# Altium schematic sheet FPGA_AudioCodec_Flash.SchDoc
size B; Organization: Altium Limited; Address1: L3, 12a Rodborough Rd; Address2: Frenchs Forest; Address3: NSW; Address4: Australia 2086; DocumentNumber: 1; SheetNumber: 1; SheetTotal: 6
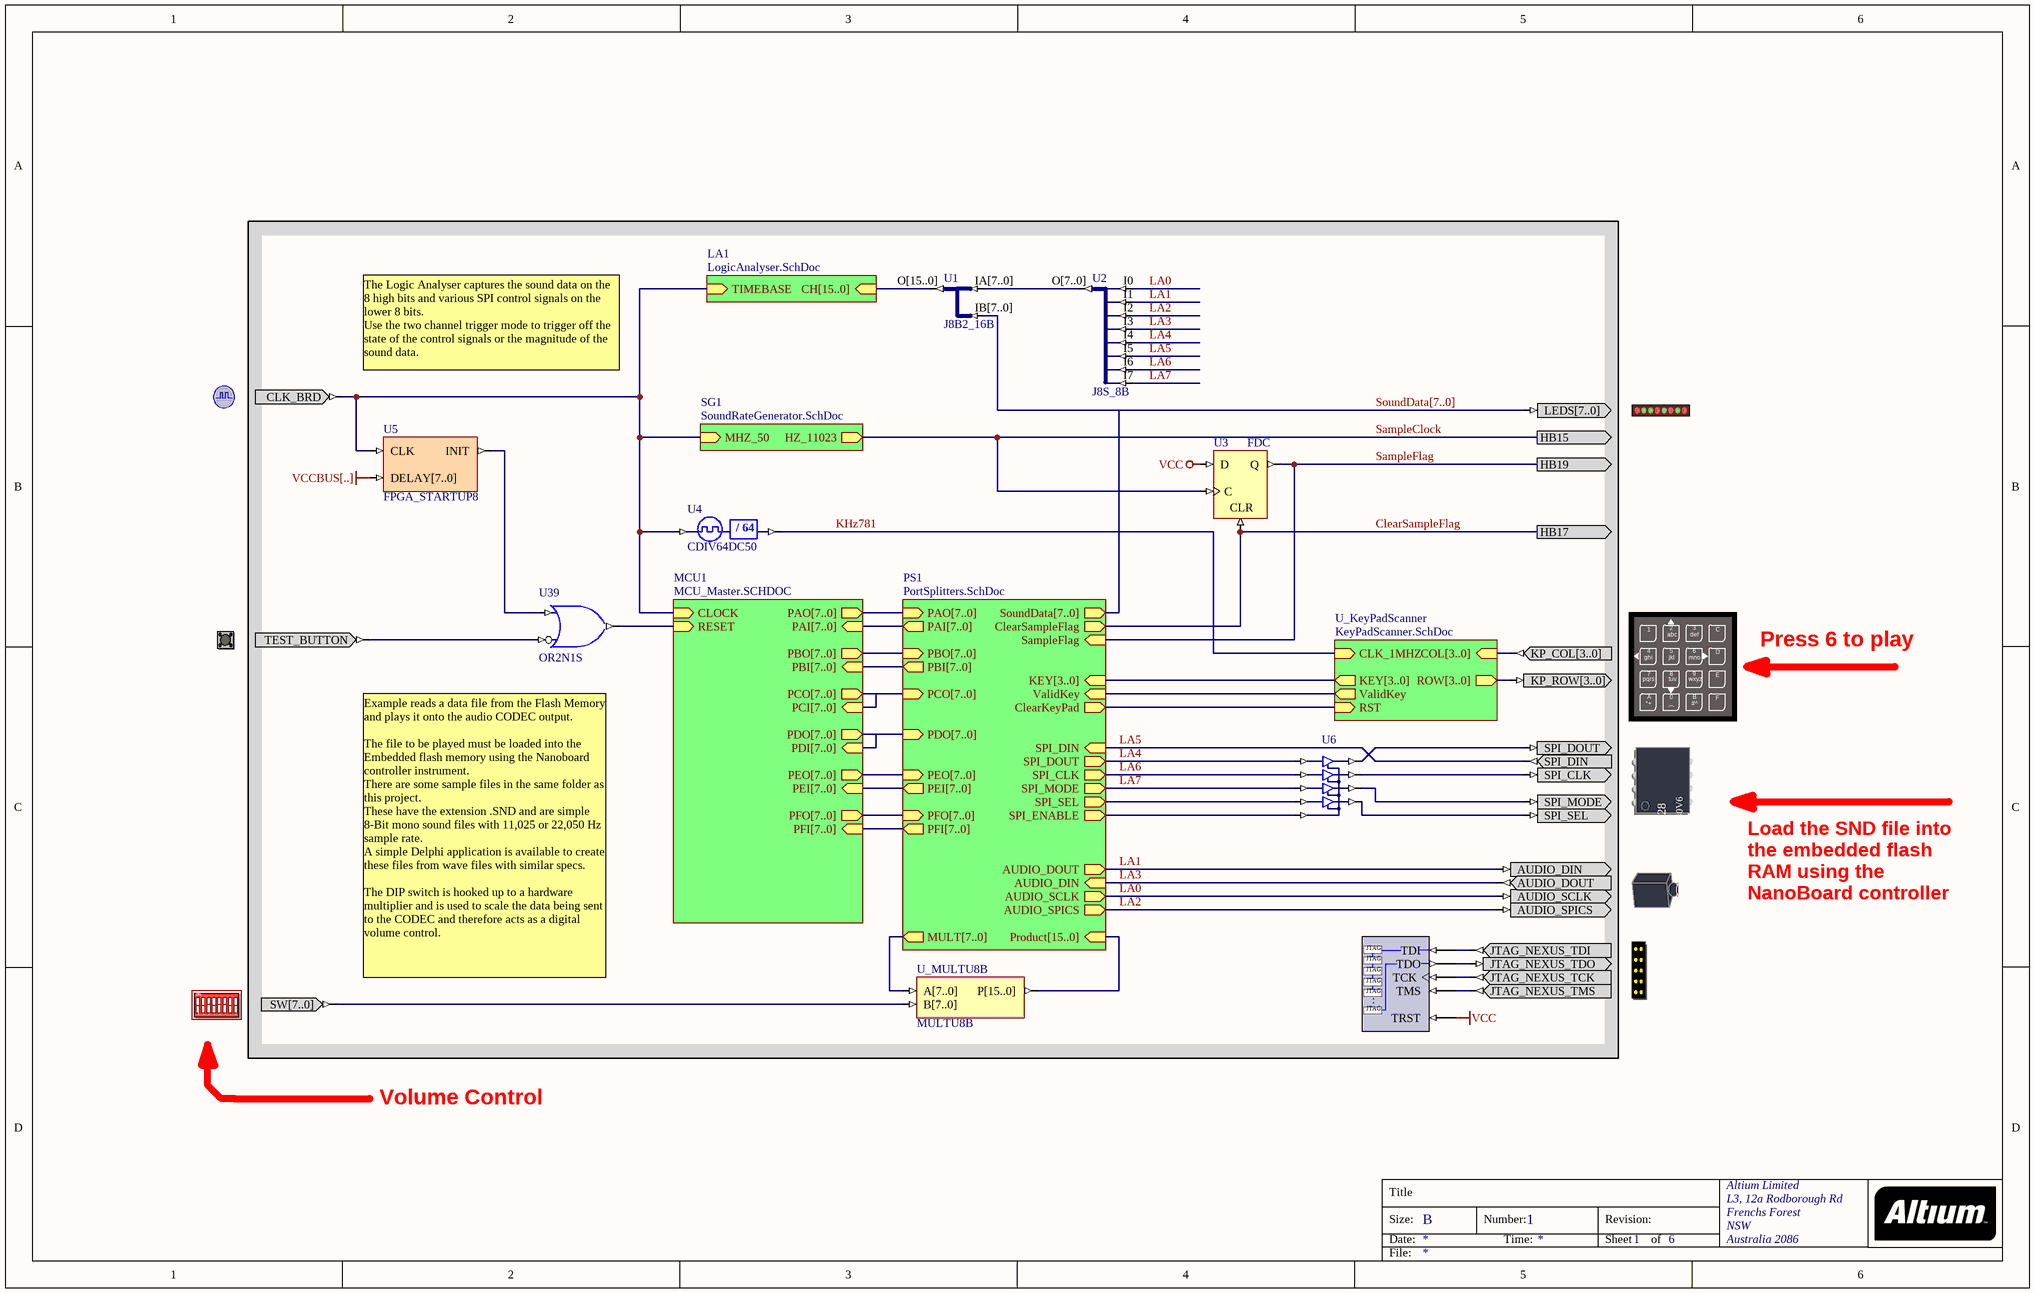
[diagram p0: FPGA_AudioCodec_Flash.SchDoc]

## Parts
(Parts that share a designator on the sheet are numbered #1, #2 ... from top to bottom, then left to right.)
?#1  CLOCK_BOARD  (value not drawn)
?#2  LED  (value not drawn)
?#3  KEYPAD  (value not drawn)
?#4  TEST_BUTTON  (value not drawn)
?#5  SERIALFMEMORY  (value not drawn)
?#6  AUDIO_DAC  (value not drawn)
?#7  NEXUS_JTAG_CONNECTOR  (value not drawn)
?#8  DIPSWITCH  (value not drawn)
NEXUS_JTAG_PORT  NEXUS_JTAG_PORT  (value not drawn)
U1  J8B2_16B
U2  J8S_8B
U3  FDC
U4  CDIV64DC50
U5  FPGA_STARTUP8
U6  BUFE4S  (value not drawn)
U39  OR2N1S
U_MULTU8B  MULTU8B

## Sub-sheets
LA1 = LogicAnalyser.SchDoc: CH[15..0] (in), TIMEBASE (in)
MCU1 = MCU_Master.SCHDOC: CLOCK (in), RESET (in), PAI[7..0] (in), PBI[7..0] (in), PAO[7..0] (out), PBO[7..0] (out), PCO[7..0] (out), PEO[7..0] (out), PDO[7..0] (out), PFO[7..0] (out), PFI[7..0] (in), PEI[7..0] (in), PCI[7..0] (in), PDI[7..0] (in)
PS1 = PortSplitters.SchDoc: SampleFlag (in), SPI_DIN (in), ClearSampleFlag (out), SPI_ENABLE (out), SPI_CLK (out), SPI_MODE (out), SPI_SEL (out), SPI_DOUT (out), PCO[7..0] (in), PBI[7..0] (out), PAI[7..0] (out), PAO[7..0] (in), PBO[7..0] (in), KEY[3..0] (in), AUDIO_DOUT (out), AUDIO_SPICS (out), AUDIO_DIN (in), PDO[7..0] (in), AUDIO_SCLK (out), SoundData[7..0] (out), ValidKey (in), ClearKeyPad (out), Product[15..0] (in), MULT[7..0] (out), PEI[7..0] (out), PFI[7..0] (out), PEO[7..0] (in), PFO[7..0] (in)
SG1 = SoundRateGenerator.SchDoc: MHZ_50 (in), HZ_11023 (out)
U_KeyPadScanner = KeyPadScanner.SchDoc: ValidKey (out), COL[3..0] (in), ROW[3..0] (out), KEY[3..0] (out), RST (in), CLK_1MHZ (in)

## Ports
HB15 (out), HB17 (out), HB19 (out)

## Nets
VCC: NEXUS_JTAG_PORT.TRST U3.D
VCCBUS[..]: U5.DELAY[7..0]
ClearSampleFlag: U3.CLR ; port HB17, sheet PS1/ClearSampleFlag
KHz781: U4.CLKDV ; sheet U_KeyPadScanner/CLK_1MHZ
LA0: ?#6.AUDIO_SCLK U2.I0 ; sheet PS1/AUDIO_SCLK
LA1: ?#6.AUDIO_DIN U2.I1 ; sheet PS1/AUDIO_DOUT
LA2: ?#6.AUDIO_SPICS U2.I2 ; sheet PS1/AUDIO_SPICS
LA3: ?#6.AUDIO_DOUT U2.I3 ; sheet PS1/AUDIO_DIN
LA4: U2.I4 U6.I3 ; sheet PS1/SPI_DOUT
LA5: ?#5.SPI_DIN U2.I5 ; sheet PS1/SPI_DIN
LA6: U2.I6 U6.I2 ; sheet PS1/SPI_CLK
LA7: U2.I7 U6.I1 ; sheet PS1/SPI_MODE
SampleClock: U3.C ; port HB15, sheet SG1/HZ_11023
SampleFlag: U3.Q ; port HB19, sheet PS1/SampleFlag
SoundData[7..0]: ?#2.LEDS[7..0] U1.IB[7..0] ; sheet PS1/SoundData[7..0]
Net?#1_CLK_BRD: ?#1.CLK_BRD U4.CLKIN U5.CLK ; sheet SG1/MHZ_50, sheet MCU1/CLOCK, sheet LA1/TIMEBASE
Net?#3_KP_COL[3..0]: ?#3.KP_COL[3..0] ; sheet U_KeyPadScanner/COL[3..0]
Net?#3_KP_ROW[3..0]: ?#3.KP_ROW[3..0] ; sheet U_KeyPadScanner/ROW[3..0]
Net?#4_TEST_BUTTON: ?#4.TEST_BUTTON U39.I0
Net?#5_SPI_CLK: ?#5.SPI_CLK U6.O2
Net?#5_SPI_DOUT: ?#5.SPI_DOUT U6.O3
Net?#5_SPI_MODE: ?#5.SPI_MODE U6.O1
Net?#5_SPI_SEL: ?#5.SPI_SEL U6.O0
Net?#7_JTAG_NEXUS_TCK: ?#7.JTAG_NEXUS_TCK NEXUS_JTAG_PORT.TCK
Net?#7_JTAG_NEXUS_TDI: ?#7.JTAG_NEXUS_TDI NEXUS_JTAG_PORT.TDI
Net?#7_JTAG_NEXUS_TDO: ?#7.JTAG_NEXUS_TDO NEXUS_JTAG_PORT.TDO
Net?#7_JTAG_NEXUS_TMS: ?#7.JTAG_NEXUS_TMS NEXUS_JTAG_PORT.TMS
Net?#8_SW[7..0]: ?#8.SW[7..0] U_MULTU8B.B[7..0]
NetU1_IA[7..0]: U1.IA[7..0] U2.O[7..0]
NetU1_O[15..0]: U1.O[15..0] ; sheet LA1/CH[15..0]
NetU5_INIT: U5.INIT U39.I1
NetU6_E: U6.E ; sheet PS1/SPI_ENABLE
NetU6_I0: U6.I0 ; sheet PS1/SPI_SEL
NetU39_O: U39.O ; sheet MCU1/RESET
NetU_MULTU8B_A[7..0]: U_MULTU8B.A[7..0] ; sheet PS1/MULT[7..0]
NetU_MULTU8B_P[15..0]: U_MULTU8B.P[15..0] ; sheet PS1/Product[15..0]
(unnamed): sheet PS1/ValidKey, sheet U_KeyPadScanner/ValidKey
(unnamed): sheet PS1/ClearKeyPad, sheet U_KeyPadScanner/RST

## Buses and harness runs
bus sheet MCU1/PAI[7..0] = sheet PS1/PAI[7..0]
bus sheet MCU1/PAO[7..0] = sheet PS1/PAO[7..0]
bus sheet MCU1/PBI[7..0] = sheet PS1/PBI[7..0]
bus sheet MCU1/PBO[7..0] = sheet PS1/PBO[7..0]
bus sheet MCU1/PCI[7..0] = sheet MCU1/PCO[7..0] = sheet PS1/PCO[7..0]
bus sheet MCU1/PDI[7..0] = sheet MCU1/PDO[7..0] = sheet PS1/PDO[7..0]
bus sheet MCU1/PEI[7..0] = sheet PS1/PEI[7..0]
bus sheet MCU1/PEO[7..0] = sheet PS1/PEO[7..0]
bus sheet MCU1/PFI[7..0] = sheet PS1/PFI[7..0]
bus sheet MCU1/PFO[7..0] = sheet PS1/PFO[7..0]
bus sheet PS1/KEY[3..0] = sheet U_KeyPadScanner/KEY[3..0]
bus SoundData[7..0] = sheet PS1/SoundData[7..0]

## Notes on the sheet
- The Logic Analyser captures the sound data on the 8 high bits and various SPI control signals on the lower 8 bits.
  Use the two channel trigger mode to trigger off the state of the control signals or the magnitude of the sound data.
- Press 6 to play
- Example reads a data file from the Flash Memory and plays it onto the audio CODEC output.
  The file to be played must be loaded into the Embedded flash memory using the Nanoboard controller instrument.
  There are some sample files in the same folder as this project.
  These have the extension .SND and are simple 8-Bit mono sound files with 11,025 or 22,050 Hz sample rate.
  A simple Delphi application is available to create these files from wave files with similar specs.
  The DIP switch is hooked up to a hardware multiplier and is used to scale the data being sent to the CODEC and therefore acts as a digital volume control.
- Load the SND file into the embedded flash RAM using the NanoBoard controller
- Volume Control
- Title
- Size:
- Date:
- B
- Number:
- Time:
- Revision:
- Sheet
- of
- File:
- (in symbol CDIV64DC50) / 64
- (in symbol DIPSWITCH) ON; 1; 2; 3; 4; 5; 6; 7; 8
- (in symbol KEYPAD) 1; 2; 3; C; abc; def; 4; 5; 6; ghi; jkl; mno; D; 7; 8; 9; E; pqrs; tuv; wxyz; A; 0; B; F; *+; (; #^
- (in symbol NEXUS_JTAG_PORT) JTAG; .
- (in symbol SERIALFMEMORY) 2SP40V6; ST 93228

## Library data of the parts
?#1 = CLOCK_BOARD: Global System Clock Supply; PortComponent: True; Published: 19-Nov-2003; Publisher: Altium Limited
?#2 = LED: 8-Way LEDS; PortComponent: True; Published: 19-Nov-2003; Publisher: Altium Limited
?#3 = KEYPAD: Key Pad; PortComponent: True; Published: 19-Nov-2003; Publisher: Altium Limited
?#4 = TEST_BUTTON: Test Button; PortComponent: True; Published: 19-Nov-2003; Publisher: Altium Limited
?#5 = SERIALFMEMORY: Serial Flash Memory; PortComponent: True; Published: 19-Nov-2003; Publisher: Altium Limited
?#6 = AUDIO_DAC: Audio Jack; PortComponent: True; Published: 19-Nov-2003; Publisher: Altium Limited
?#7 = NEXUS_JTAG_CONNECTOR: JTAG Port; PortComponent: True; Published: 19-Nov-2003; Publisher: Altium Limited
?#8 = DIPSWITCH: 8-Way Dip Switch; PortComponent: True; Published: 19-Nov-2003; Publisher: Altium Limited
NEXUS_JTAG_PORT = NEXUS_JTAG_PORT: Soft Nexus-Chain Connector; NEXUS_JTAG_CONNECTOR: True; Published: 18-Dec-2003; Publisher: Altium Limited
U1 = J8B2_16B: 2 x 8-Bit input bus to 1 x 16-bit output bus; ArchiveName: GENERIC; Published: 18-Nov-2003; Publisher: Altium Limited; Core Revision: 1.00.00
U2 = J8S_8B: 8 Single pin inputs to single 8-Bit output bus; ArchiveName: GENERIC; Published: 18-Nov-2003; Publisher: Altium Limited; Core Revision: 1.00.00
U3 = FDC: D-Type Flip-Flop with Asynchronous Clear; ArchiveName: GENERIC; Published: 18-Dec-2003; Publisher: Altium Limited; Xilinx Equivalent: FDC; Core Revision: 1.00.00
U4 = CDIV64DC50: Clock Divider by 64 with 50% Duty Cycle Output; ArchiveName: GENERIC; Published: 18-Dec-2003; Publisher: Altium Limited; Core Revision: 1.00.00
U5 = FPGA_STARTUP8: FPGA Startup With 8 Bit Delay; Published: 21/01/2004; Publisher: Altium Hobart Technology Centre; Core Revision: 1.00.00
U6 = BUFE4S: 4-Bit 3-state Buffer with Active High Enable, Single Pin Version; Xilinx Equivalent: BUFE4; ArchiveName: GENERIC; Published: 18-Nov-2003; Publisher: Altium Limited; Core Revision: 1.00.00
U39 = OR2N1S: 2-Input OR Gate with Active Low A Input, Single Pin Version; Xilinx Equivalent: OR2B1; ArchiveName: GENERIC; Published: 18-Dec-2003; Publisher: Altium Limited; Core Revision: 1.00.00
U_MULTU8B = MULTU8B: 8x8 Unsigned Multiplier, Bus Version; ArchiveName: GENERIC; Published: 18-Dec-2003; Publisher: Altium Limited; Core Revision: 1.00.00